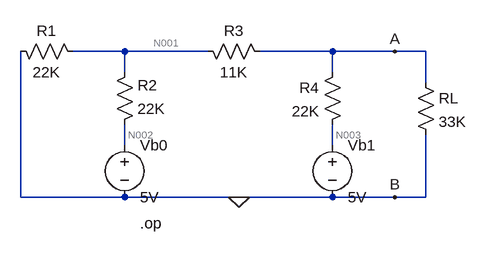
[diagram p0: schematic Thevenin1.asc]
Thevenin1.asc, the LTspice schematic file:
Version 4
SHEET 1 880 680
WIRE 112 -320 32 -320
WIRE 240 -320 112 -320
WIRE 432 -320 320 -320
WIRE 528 -320 432 -320
WIRE 576 -320 528 -320
WIRE 112 -288 112 -320
WIRE 432 -288 432 -320
WIRE 576 -272 576 -320
WIRE 112 -176 112 -208
WIRE 432 -176 432 -208
WIRE -48 -96 -48 -320
WIRE 112 -96 -48 -96
WIRE 288 -96 112 -96
WIRE 432 -96 288 -96
WIRE 528 -96 432 -96
WIRE 576 -96 576 -192
WIRE 576 -96 528 -96
FLAG 528 -320 A
FLAG 528 -96 B
FLAG 288 -96 0
DATAFLAG 512 -96 ""
DATAFLAG 512 -320 ""
SYMBOL res -64 -336 M90
WINDOW 0 0 56 VBottom 2
WINDOW 3 32 56 VTop 2
SYMATTR InstName R1
SYMATTR Value 22K
SYMBOL res 96 -192 M180
WINDOW 0 36 76 Left 2
WINDOW 3 36 40 Left 2
SYMATTR InstName R2
SYMATTR Value 22K
SYMBOL res 336 -304 M270
WINDOW 0 32 56 VTop 2
WINDOW 3 0 56 VBottom 2
SYMATTR InstName R3
SYMATTR Value 11K
SYMBOL res 448 -304 M0
SYMATTR InstName R4
SYMATTR Value 22K
SYMBOL voltage 112 -192 R0
SYMATTR InstName Vb0
SYMATTR Value 5V
SYMBOL voltage 432 -192 R0
SYMATTR InstName Vb1
SYMATTR Value 5V
SYMBOL res 560 -288 R0
SYMATTR InstName RL
SYMATTR Value 33K
TEXT 136 -56 Left 2 !.op

The netlist it stands for:
* Thevenin1.asc
R1 0 N001 22K
R2 N002 N001 22K
R3 A N001 11K
R4 A N003 22K
Vb0 N002 0 5V
Vb1 N003 0 5V
RL A 0 33K
.op
.backanno
.end

* Results of the author's LTspice run, read from the files saved beside the schematic
* Operating Point:
*   V(n001) = 2.656 V
*   V(n002) = 5 V
*   V(a) = 2.812 V
*   V(n003) = 5 V
*   I(Rl) = 85.23 µA
*   I(R4) = -99.43 µA
*   I(R3) = 14.2 µA
*   I(R2) = 106.5 µA
*   I(R1) = -120.7 µA
*   I(Vb1) = -99.43 µA
*   I(Vb0) = -106.5 µA